# EAGLE design Arduino_Uno_Sheild (EAGLE 9.6.2)
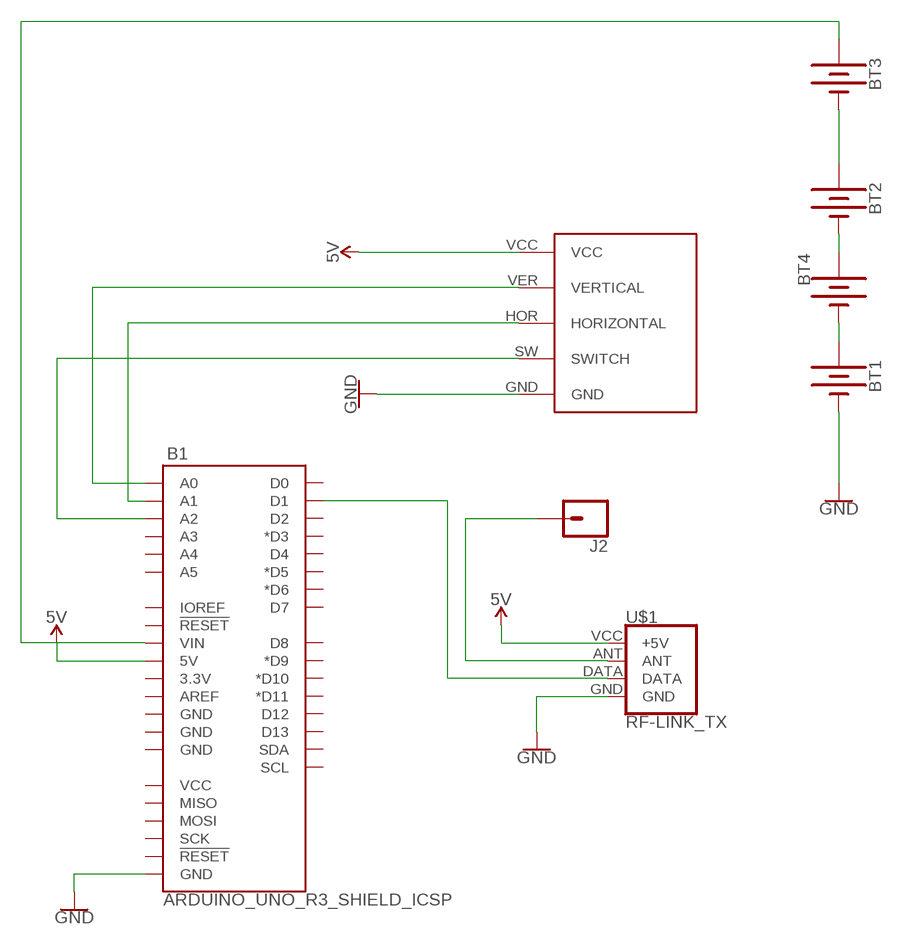
[diagram p0: schematic, sheet 1]

## Parts
B1  ARDUINO_UNO_R3_SHIELD_ICSP  [UNO_R3_SHIELD_ICSP]
BT1  BATTERY-AAA  [BATTERY-AAA]
BT2  BATTERY-AAA  [BATTERY-AAA]
BT3  BATTERY-AAA  [BATTERY-AAA]
BT4  BATTERY-AAA  [BATTERY-AAA]
J2  CONN_01POGOPIN_HOLE_0.58  [1X01_POGOPIN_HOLE_0.58_DIA]
JOYSTICK1  JOYSTICK  [JOYSTICK]
U$1  RF-LINK_TX  [RF-LINK_TX]

## Nets
5V: B1.5V JOYSTICK1.VCC U$1.VCC(+5V)
GND: B1.GND_ICSP(GND) BT1.GND@1(-) JOYSTICK1.GND U$1.GND
N$1: B1.TX(D1) U$1.DATA
N$2: J2.1 U$1.ANT
N$3: B1.A0 JOYSTICK1.VER(VERTICAL)
N$4: B1.A1 JOYSTICK1.HOR(HORIZONTAL)
N$5: B1.A2 JOYSTICK1.SW(SWITCH)
N$6: B1.VIN BT3.PWR@1(+)
N$7: BT2.PWR@1(+) BT3.GND@1(-)
N$8: BT2.GND@1(-) BT4.PWR@1(+)
N$9: BT1.PWR@1(+) BT4.GND@1(-)
Unconnected: B1.3.3V B1.5V_ICSP(VCC) B1.A3 B1.A4 B1.A5 B1.AREF B1.D2 B1.D3(*D3) B1.D4 B1.D5(*D5) B1.D6(*D6) B1.D7 B1.D8 B1.D9(*D9) B1.D10(*D10) B1.D11(*D11) B1.D12 B1.D13 B1.GND@0(GND) B1.GND@1(GND) B1.GND@2(GND) B1.IOREF B1.MISO B1.MOSI B1.RES(!RESET!) B1.RST_ICSP(!RESET!) B1.RX(D0) B1.SCK B1.SCL B1.SDA

## Library data of the parts
B1 = SparkFun-Boards:ARDUINO_UNO_R3_SHIELD_ICSP: Arduino R3 Shield Footprint with ICSP Header Includes pins for 6-pin (2x3) ICSP Header. Compatible with Leonardo boards that require SPI pin connections via this header. SparkFun Products: CryptoShield <https://www.sparkfun.com/products/13183> microSD Shield <https://www.sparkfun.com/products/12761> R3 Stackable Headers Kit <https://www.sparkfun.com/products/1417>
BT1-BT4 = SparkFun-Batteries:BATTERY: Battery - Single Cell A variety of battery chemistries, sizes, and footprints. Device List: 20MM_PTH - Coin Cell Battery Holder - 20mm (PTH) <https://www.sparkfun.com/products/783> 6.8MM_PTH - Coin Cell Battery Holder - 6.8MM(SMD) <https://www.digikey.com/product-detail/en/seiko-instruments/MS621FE-FL11E/728-1057-ND/1889208?WT.srch=1&gclid=CNOQ5a6LzdQCFZS2wAodXCkE0g> 12MM_SMD - Coin Cell Battery Holder - 12mm (SMD) <https://www.sparkfun.com/products/10592> 12MM_PTH - Coin Cell Battery Holder - 12mm (PTH) <https://www.sparkfun.com/products/7948> 20MM_SMD - 20mm Coin Cell Battery Holder (SMD) (2 legs) Used on the Big Time Watch Kit <https://www.sparkfun.com/products/11734> 20MM_SMD_4LEGS - Coin Cell Battery Holder - 20mm (SMD) <https://www.sparkfun.com/products/11892> 20MM_SMD_4LEGS_OVERPASTE - Coin Cell Battery Holder - 20mm (SMD) <https://www.sparkfun.com/products/11892> (Over-paste on the legs) 24.5MM_PTH - Coin Cell Battery Holder - 24.5mm (PTH) <https://www.sparkfun.com/products/8863> 9V - 9V Battery Holder - PC Mount Used on the SparkFun SparkPunk Sound Kit <https://www.sparkfun.com/products/11177> and SparkFun SparkPunk Sequencer Kit <https://www.sparkfun.com/products/12707> 18650 - Battery Holder - 18650 (PTH) <https://www.sparkfun.com/products/13113> AA - Battery Holder - 1xAA (PTH) <https://www.sparkfun.com/products/7949> AAA - Battery Holder - 1xAAA (PTH) <https://www.sparkfun.com/products/12718> AA_KIT - Battery Holder - 1xAA (PTH) <https://www.sparkfun.com/products/7949> Special kit package - pads only have exposed copper on one side of the board. AAA_KIT - Battery Holder - 1xAAA (PTH) <https://www.sparkfun.com/products/12718> Special kit package - pads only have exposed copper on one side of the board.; PROD_ID: BATT-08571; SF_SKU: PRT-12718
J2 = SparkFun-Connectors:CONN_01: Single connection point. Often used as Generic Header-pin footprint for 0.1 inch spaced/style header connections On any of the 0.1 inch spaced packages, you can populate with these: Break Away Headers - Straight <https://www.sparkfun.com/products/116> (PRT-00116) Break Away Male Headers - Right Angle <https://www.sparkfun.com/products/553> (PRT-00553) Female Headers <https://www.sparkfun.com/products/115> (PRT-00115) Break Away Headers - Machine Pin <https://www.sparkfun.com/products/117> (PRT-00117) Break Away Female Headers - Swiss Machine Pin <https://www.sparkfun.com/products/743> (PRT-00743) This device is also useful as a general connection point to wire up your design to another part of your project. Our various solder wires solder well into these plated through hole pads. Hook-Up Wire - Assortment (Stranded, 22 AWG) <https://www.sparkfun.com/products/11375> (PRT-11375) Hook-Up Wire - Assortment (Solid Core, 22 AWG) <https://www.sparkfun.com/products/11367> (PRT-11367) View the entire wire category on our website here <https://www.sparkfun.com/categories/141> Special notes: SMTSO-256-ET is a "flush mount" nut for a 4-40 screw. We mostly use this on specialty testbeds; it is a nice way to connect hardware to your PCB at an adjustable hieght. Also note, the SNAP packages are for using a snappable style connector. We sell a baggie of snaps and they are also used on two LilyPad designs: Snap Assortment - 30 pack (male and female) <https://www.sparkfun.com/products/11347> (DEV-11347) LilyPad Arduino SimpleSnap <https://www.sparkfun.com/products/10941> (DEV-10941) LilyPad SimpleSnap Protoboard <https://www.sparkfun.com/products/10940> (DEV-10940)
JOYSTICK1 = ECEN2440:JOYSTICK
U$1 = SparkFun-RF:RF-LINK_TX: RF Link Transmitter (434 MHz, 315 MHz) These wireless transmitters work with equivalent receivers. They can easily fit into a breadboard and work well with microcontrollers to create a very simple wireless data link. Since these are only transmitters, they will only work communicating data one-way, you would need two pairs (of different frequencies) to act as a transmitter/receiver pair. SparkFun Products RF Link Transmitter - 434MHz <https://www.sparkfun.com/products/10534> (WRL-10534); SF_ID: WRL-10534

## Board
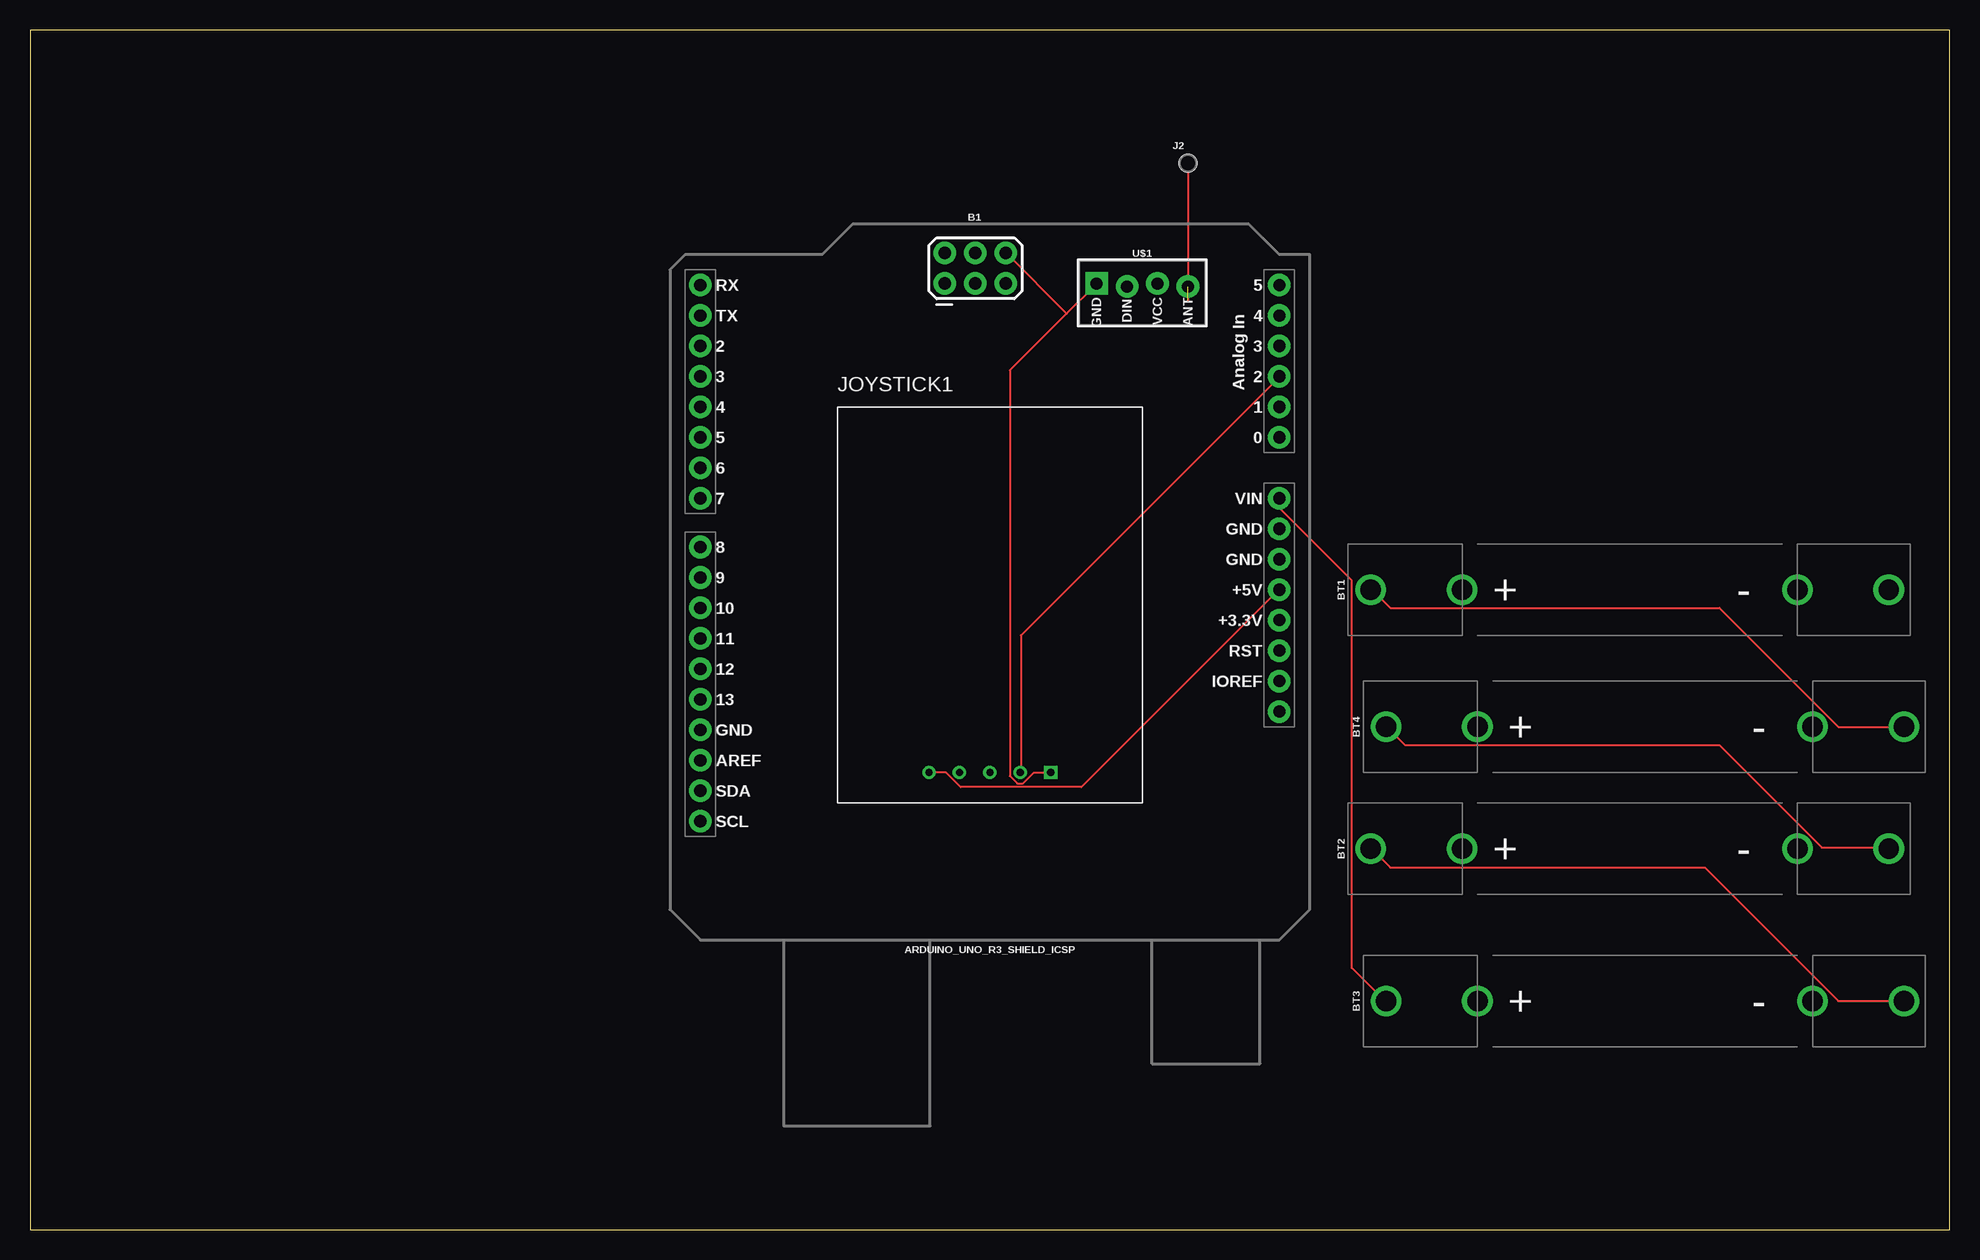
[diagram p1: board, top side]
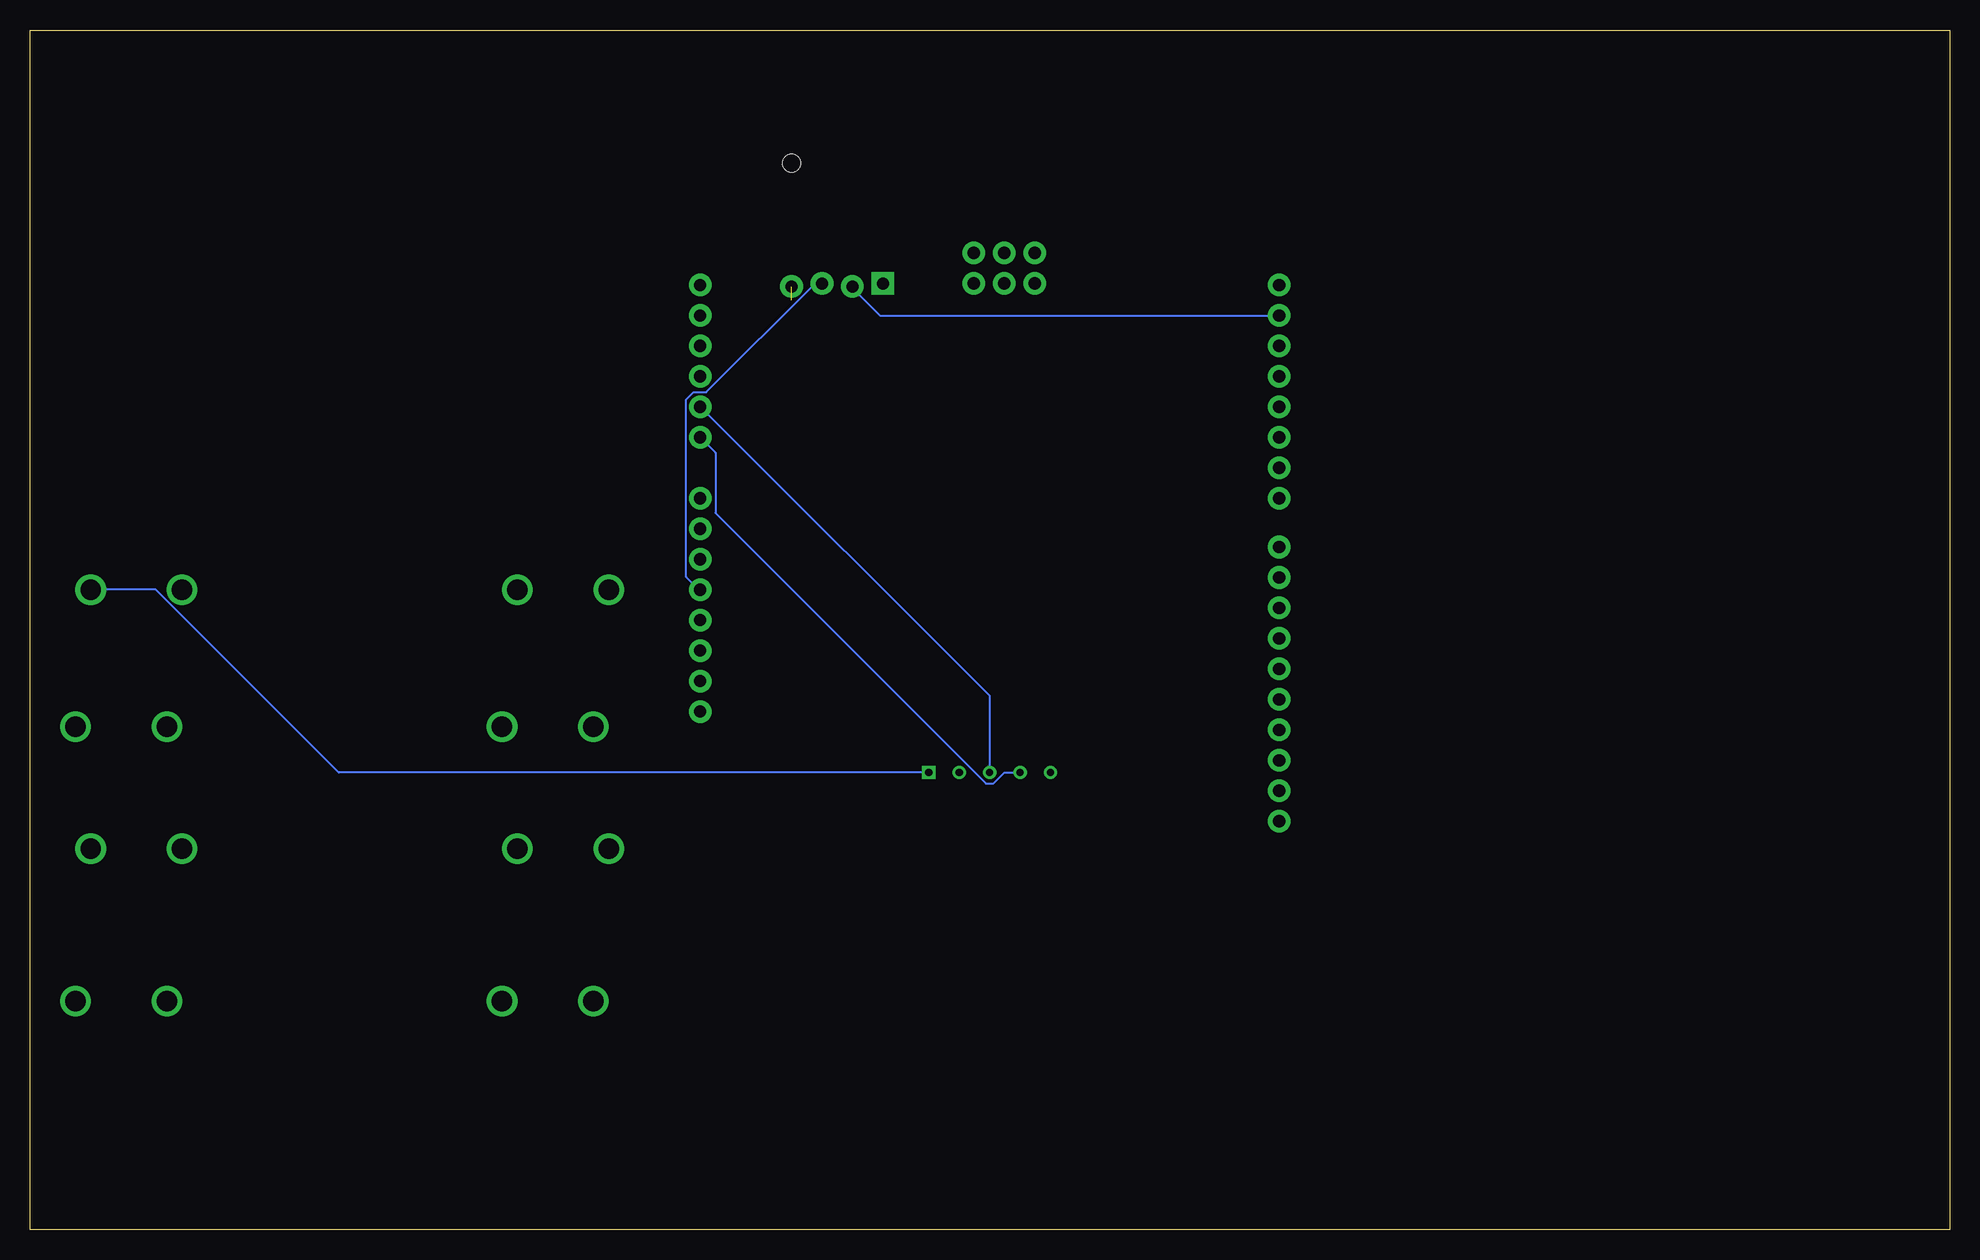
[diagram p2: board, bottom side, seen from below]

Size 160 x 100 mm. Coordinates in mm from the lower left corner, seen from the top.
Outline: 0,0 160,0 160,100 0,100 0,0
Copper layers (1*16): Top 0.035mm / dielectric 1.5mm / Bottom 0.035mm
Design rules "default": minimum track width 6mil, minimum drill 0.35mm, track to track 6mil, track to pad 6mil, pad to pad 6mil, via to via 6mil, smd to smd 6mil, copper to edge 40mil, drill to drill 6mil, minimum pad ring 10mil, minimum via ring 8mil, stop-mask expansion 4mil, vias tented up to drill 0mil, thermal gap 10mil

### Footprints (pad centres in the part's own frame; a part is rotated, then mirrored left to right if it is on the bottom)
UNO_R3_SHIELD_ICSP = drill 1.016 pad 1.88: 3.3V 24.13,-3.81; 5V 24.13,-1.27; 5V_ICSP -3.76,26.81; A0 24.13,11.43; A1 24.13,13.97; A2 24.13,16.51; A3 24.13,19.05; A4 24.13,21.59; A5 24.13,24.13; AREF -24.13,-15.494; D2 -24.13,19.05; D3 -24.13,16.51; D4 -24.13,13.97; D5 -24.13,11.43; D6 -24.13,8.89; D7 -24.13,6.35; D8 -24.13,2.286; D9 -24.13,-0.254; D10 -24.13,-2.794; D11 -24.13,-5.334; D12 -24.13,-7.874; D13 -24.13,-10.414; GND@0 24.13,1.27; GND@1 24.13,3.81; GND@2 -24.13,-12.954; GND_ICSP 1.32,26.81; IOREF 24.13,-8.89; MISO -3.76,24.27; MOSI -1.22,26.81; NC 24.13,-11.43; RES 24.13,-6.35; RST_ICSP 1.32,24.27; RX -24.13,24.13; SCK -1.22,24.27; SCL -24.13,-20.574; SDA -24.13,-18.034; TX -24.13,21.59; VIN 24.13,6.35
BATTERY-AAA = drill 1.702: GND@1 21.59,0; GND@2 13.97,0; PWR@1 -21.59,0; PWR@2 -13.97,0
1X01_POGOPIN_HOLE_0.58_DIA = drill 0.9 pad 0.813: 1 0,0 | hole 1.473: 0,0
JOYSTICK = drill 0.6 square: GND -7.62,2.54 | drill 0.6: HOR -12.7,2.54; SW -10.16,2.54; VCC -17.78,2.54; VER -15.24,2.54
RF-LINK_TX = drill 1.016 pad 1.88: ANT 3.81,-0.127; DATA -1.27,-0.127; VCC 1.27,0.127 | drill 1.016 pad 1.88 square: GND -3.81,0.127

### Placement (x,y rotation side)
B1  80.01,54.61 0 top
BT1  133.35,53.34 0 top
BT2  133.35,31.75 0 top
BT3  134.62,19.05 0 top
BT4  134.62,41.91 0 top
J2  96.52,88.9 0 top
JOYSTICK1  92.71,35.56 0 top
U$1  92.71,78.74 0 top

### Tracks (layer width: path | path; a pad name or v marks a point on that pad's centre or on a via)
5V
  Top 0.152: JOYSTICK1.VCC 76.35,38.1 77.57,36.88 87.63,36.88 104.09,53.34 B1.5V
  Bottom 0.152: U$1.VCC 94.03,78.79 94.64,78.79 103.63,69.8 104.7,69.8 105.31,69.19 105.31,54.41 104.24,53.34 B1.5V
GND
  Top 0.152: JOYSTICK1.GND 83.67,38.1 82.75,37.19 82.3,37.19 81.69,37.8 81.69,71.63 86.41,76.35 | 86.41,76.35 88.85,78.79 U$1.GND | 86.41,76.35 81.38,81.38 B1.GND_ICSP
  Bottom 0.152: BT1.GND@1 149.5,53.34 134.26,38.1 JOYSTICK1.GND
N$1
  Bottom 0.152: B1.TX 89.15,76.2 91.44,78.49 U$1.DATA
N$2  (1 unrouted)
  Top 0.152: J2.1 96.52,77.47
N$3
  Bottom 0.152: JOYSTICK1.VER 78.79,38.1 79.7,37.19 80.31,37.19 102.87,59.74 102.87,64.77 B1.A0
N$4
  Bottom 0.152: JOYSTICK1.HOR 80.01,44.5 104.09,68.58 B1.A1
N$5
  Top 0.152: JOYSTICK1.SW 82.6,38.1 82.6,49.53 104.09,71.02 B1.A2
N$6
  Top 0.152: B1.VIN 104.24,60.96 104.24,60.05 110.19,54.1 110.19,21.79 112.93,19.05 BT3.PWR@1
N$7
  Top 0.152: BT3.GND@1 150.72,19.05 139.6,30.18 113.39,30.18 111.86,31.7 BT2.PWR@1
N$8
  Top 0.152: BT2.GND@1 154.84,31.85 149.35,31.85 140.82,40.39 114.61,40.39 113.08,41.91 BT4.PWR@1
N$9
  Top 0.152: BT4.GND@1 150.72,41.91 140.82,51.82 113.39,51.82 111.86,53.34 BT1.PWR@1